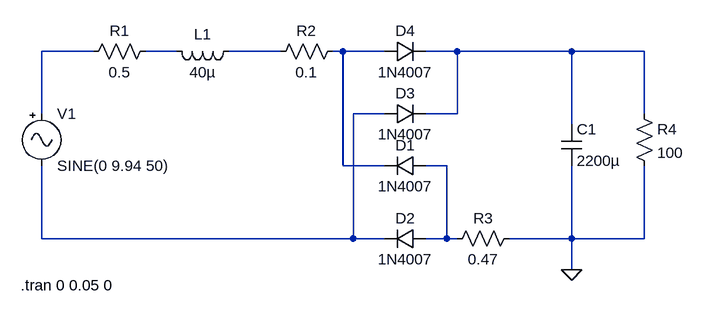
[diagram p0: schematic AEkg3Opgv2.asc]
AEkg3Opgv2.asc, the LTspice schematic file:
Version 4
SHEET 1 880 680
WIRE -272 16 -352 16
WIRE -144 16 -192 16
WIRE 16 16 -64 16
WIRE 112 16 96 16
WIRE 176 16 112 16
WIRE 288 16 240 16
WIRE 464 16 288 16
WIRE 576 16 464 16
WIRE -352 112 -352 16
WIRE 176 112 128 112
WIRE 288 112 288 16
WIRE 288 112 240 112
WIRE 576 112 576 16
WIRE 464 128 464 16
WIRE 112 192 112 16
WIRE 176 192 112 192
WIRE 272 192 240 192
WIRE -352 304 -352 192
WIRE 128 304 128 112
WIRE 128 304 -352 304
WIRE 176 304 128 304
WIRE 272 304 272 192
WIRE 272 304 240 304
WIRE 288 304 272 304
WIRE 464 304 464 192
WIRE 464 304 368 304
WIRE 576 304 576 192
WIRE 576 304 464 304
WIRE 464 352 464 304
FLAG 464 352 0
SYMBOL res -176 0 R90
WINDOW 0 0 56 VBottom 2
WINDOW 3 32 56 VTop 2
SYMATTR InstName R1
SYMATTR Value 0.5
SYMBOL res 112 0 R90
WINDOW 0 0 56 VBottom 2
WINDOW 3 32 56 VTop 2
SYMATTR InstName R2
SYMATTR Value 0.1
SYMBOL ind -48 0 R90
WINDOW 0 5 56 VBottom 2
WINDOW 3 32 56 VTop 2
SYMATTR InstName L1
SYMATTR Value 40µ
SYMBOL diode 240 176 R90
WINDOW 0 0 32 VBottom 2
WINDOW 3 32 32 VTop 2
SYMATTR InstName D1
SYMATTR Value 1N4007
SYMBOL diode 240 288 R90
WINDOW 0 0 32 VBottom 2
WINDOW 3 32 32 VTop 2
SYMATTR InstName D2
SYMATTR Value 1N4007
SYMBOL diode 176 128 R270
WINDOW 0 32 32 VTop 2
WINDOW 3 0 32 VBottom 2
SYMATTR InstName D3
SYMATTR Value 1N4007
SYMBOL diode 176 32 R270
WINDOW 0 32 32 VTop 2
WINDOW 3 0 32 VBottom 2
SYMATTR InstName D4
SYMATTR Value 1N4007
SYMBOL res 384 288 R90
WINDOW 0 0 56 VBottom 2
WINDOW 3 32 56 VTop 2
SYMATTR InstName R3
SYMATTR Value 0.47
SYMBOL cap 448 128 R0
SYMATTR InstName C1
SYMATTR Value 2200µ
SYMBOL res 560 96 R0
SYMATTR InstName R4
SYMATTR Value 100
SYMBOL Misc\\signal -352 96 R0
WINDOW 123 0 0 Left 0
WINDOW 39 0 0 Left 0
SYMATTR InstName V1
SYMATTR Value SINE(0 9.94 50)
TEXT -384 376 Left 2 !.tran 0 0.05 0

The netlist it stands for:
* AEkg3Opgv2.asc
R1 N002 N001 0.5
R2 N004 N003 0.1
L1 N003 N002 40µ
D1 N007 N004 1N4007
D2 N007 N006 1N4007
D3 N006 N005 1N4007
D4 N004 N005 1N4007
R3 0 N007 0.47
C1 N005 0 2200µ
R4 N005 0 100
V1 N001 N006 SINE(0 9.94 50)
.model D D
.lib standard.dio
.tran 0 0.05 0
.backanno
.end